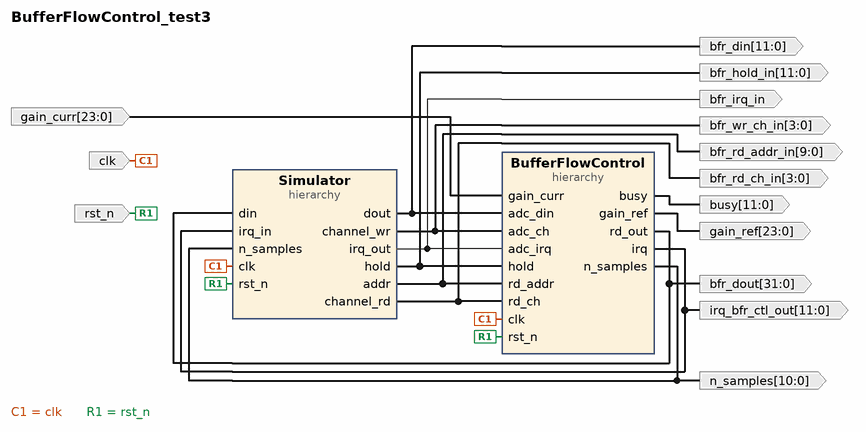
[diagram p0: block diagram of the top level]
# Vivado block design BufferFlowControl_test3, xczu3eg-sbva484-1-i, Vivado 2020.2
create_bd_design BufferFlowControl_test3

create_bd_port -dir I -type clk clk
create_bd_port -dir I -from 23 -to 0 gain_curr
create_bd_port -dir O -from 23 -to 0 gain_ref
create_bd_port -dir I -type rst rst_n
create_bd_port -dir O -from 11 -to 0 busy
create_bd_port -dir O -from 10 -to 0 n_samples
create_bd_port -dir O -from 11 -to 0 irq_bfr_ctl_out
create_bd_port -dir O -from 31 -to 0 bfr_dout
create_bd_port -dir O bfr_irq_in
create_bd_port -dir O -from 11 -to 0 bfr_din
create_bd_port -dir O -from 3 -to 0 bfr_wr_ch_in
create_bd_port -dir O -from 11 -to 0 bfr_hold_in
create_bd_port -dir O -from 9 -to 0 bfr_rd_addr_in
create_bd_port -dir O -from 3 -to 0 bfr_rd_ch_in

create_bd_cell -type hier BufferFlowControl
create_bd_cell -type hier Simulator

# ---- hierarchy /BufferFlowControl ----
current_bd_instance /BufferFlowControl
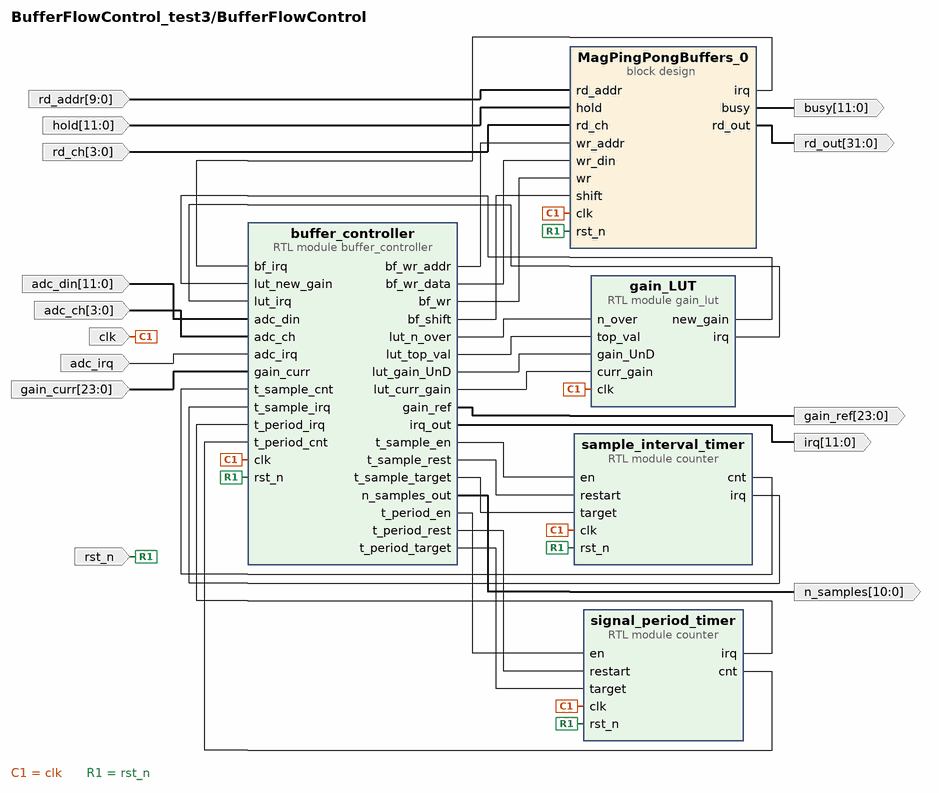
[diagram p1: block diagram inside /BufferFlowControl]
create_bd_pin -dir I -type clk clk
create_bd_pin -dir I -type rst rst_n
create_bd_pin -dir I -from 11 -to 0 adc_din
create_bd_pin -dir I -from 3 -to 0 adc_ch
create_bd_pin -dir I -type intr adc_irq
create_bd_pin -dir I -from 23 -to 0 gain_curr
create_bd_pin -dir O -from 23 -to 0 gain_ref
create_bd_pin -dir O -from 10 -to 0 n_samples
create_bd_pin -dir O -from 11 -to 0 irq
create_bd_pin -dir I -from 9 -to 0 rd_addr
create_bd_pin -dir I -from 11 -to 0 hold
create_bd_pin -dir I -from 3 -to 0 rd_ch
create_bd_pin -dir O -from 11 -to 0 busy
create_bd_pin -dir O -from 31 -to 0 rd_out

create_bd_cell -type module -reference counter sample_interval_timer
set_property -dict {CONFIG.auto_rst {"0"} CONFIG.n_bits 20} [get_bd_cells sample_interval_timer]
create_bd_cell -type module -reference counter signal_period_timer
set_property -dict {CONFIG.auto_rst {"0"} CONFIG.n_bits 21} [get_bd_cells signal_period_timer]
create_bd_cell -type module -reference gain_lut gain_LUT
create_bd_cell -type container -reference MagPingPongBuffers MagPingPongBuffers_0
set_property -dict [list \
  CONFIG.ACTIVE_SIM_BD MagPingPongBuffers.bd \
  CONFIG.ACTIVE_SYNTH_BD MagPingPongBuffers.bd \
  CONFIG.ENABLE_DFX 0 \
  CONFIG.LIST_SIM_BD MagPingPongBuffers.bd \
  CONFIG.LIST_SYNTH_BD MagPingPongBuffers.bd \
  CONFIG.LOCK_PROPAGATE 0 \
  CONFIG.TRAINING_MODULE MagPingPongBuffers.bd \
] [get_bd_cells MagPingPongBuffers_0]
create_bd_cell -type module -reference buffer_controller buffer_controller
set_property -dict {CONFIG.bf_addr_n_bits 10} [get_bd_cells buffer_controller]

# ---- hierarchy /Simulator ----
current_bd_instance /Simulator
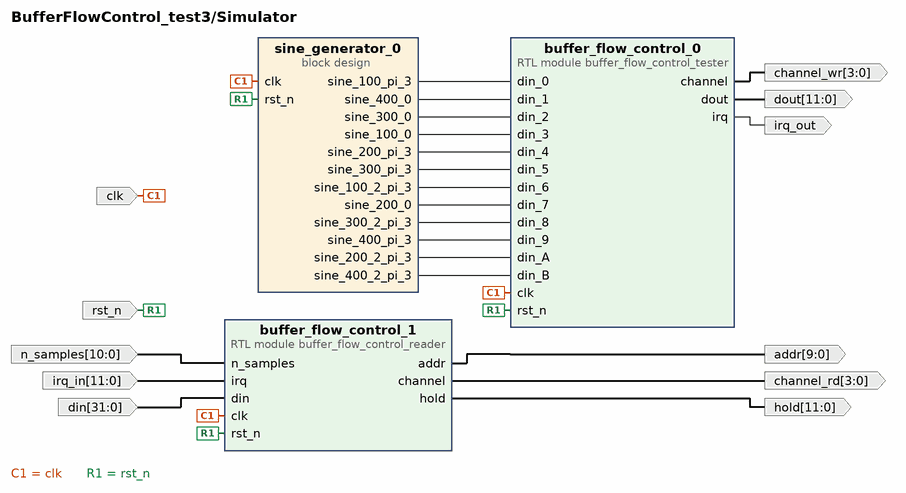
[diagram p2: block diagram inside /Simulator]
create_bd_pin -dir I -type clk clk
create_bd_pin -dir I -type rst rst_n
create_bd_pin -dir O irq_out
create_bd_pin -dir O -from 11 -to 0 dout
create_bd_pin -dir O -from 3 -to 0 channel_wr
create_bd_pin -dir O -from 11 -to 0 hold
create_bd_pin -dir O -from 9 -to 0 addr
create_bd_pin -dir O -from 3 -to 0 channel_rd
create_bd_pin -dir I -from 10 -to 0 n_samples
create_bd_pin -dir I -from 11 -to 0 irq_in
create_bd_pin -dir I -from 31 -to 0 din

create_bd_cell -type module -reference buffer_flow_control_tester buffer_flow_control_0
create_bd_cell -type container -reference sine_generator sine_generator_0
set_property -dict [list \
  CONFIG.ACTIVE_SIM_BD sine_generator.bd \
  CONFIG.ACTIVE_SYNTH_BD sine_generator.bd \
  CONFIG.ENABLE_DFX 0 \
  CONFIG.LIST_SIM_BD sine_generator.bd \
  CONFIG.LIST_SYNTH_BD sine_generator.bd \
  CONFIG.LOCK_PROPAGATE 0 \
  CONFIG.TRAINING_MODULE sine_generator.bd \
] [get_bd_cells sine_generator_0]
create_bd_cell -type module -reference buffer_flow_control_reader buffer_flow_control_1

# ---- connections ----

current_bd_instance /BufferFlowControl
connect_bd_net -net buffer_controller_t_sm_mg_int_en [get_bd_pins buffer_controller/t_sample_en] [get_bd_pins sample_interval_timer/en]
connect_bd_net -net buffer_controller_t_sm_mg_int_rest [get_bd_pins buffer_controller/t_sample_rest] [get_bd_pins sample_interval_timer/restart]
connect_bd_net [get_bd_pins buffer_controller/t_sample_target] [get_bd_pins sample_interval_timer/target]
connect_bd_net -net sample_mag_interval_timer_cnt [get_bd_pins sample_interval_timer/cnt] [get_bd_pins buffer_controller/t_sample_cnt]
connect_bd_net -net sample_mag_interval_timer_irq [get_bd_pins sample_interval_timer/irq] [get_bd_pins buffer_controller/t_sample_irq]
connect_bd_net -net buffer_controller_t_sg_prd_en [get_bd_pins buffer_controller/t_period_en] [get_bd_pins signal_period_timer/en]
connect_bd_net -net buffer_controller_t_sg_prd_rest [get_bd_pins buffer_controller/t_period_rest] [get_bd_pins signal_period_timer/restart]
connect_bd_net [get_bd_pins signal_period_timer/irq] [get_bd_pins buffer_controller/t_period_irq]
connect_bd_net [get_bd_pins signal_period_timer/cnt] [get_bd_pins buffer_controller/t_period_cnt]
connect_bd_net [get_bd_pins buffer_controller/t_period_target] [get_bd_pins signal_period_timer/target]
connect_bd_net [get_bd_pins buffer_controller/lut_n_over] [get_bd_pins gain_LUT/n_over]
connect_bd_net [get_bd_pins buffer_controller/lut_top_val] [get_bd_pins gain_LUT/top_val]
connect_bd_net [get_bd_pins buffer_controller/lut_gain_UnD] [get_bd_pins gain_LUT/gain_UnD]
connect_bd_net [get_bd_pins buffer_controller/lut_curr_gain] [get_bd_pins gain_LUT/curr_gain]
connect_bd_net [get_bd_pins gain_LUT/new_gain] [get_bd_pins buffer_controller/lut_new_gain]
connect_bd_net [get_bd_pins gain_LUT/irq] [get_bd_pins buffer_controller/lut_irq]
connect_bd_net [get_bd_pins clk] \
  [get_bd_pins signal_period_timer/clk] [get_bd_pins sample_interval_timer/clk] [get_bd_pins gain_LUT/clk] \
  [get_bd_pins MagPingPongBuffers_0/clk] [get_bd_pins buffer_controller/clk]
connect_bd_net [get_bd_pins rst_n] \
  [get_bd_pins signal_period_timer/rst_n] [get_bd_pins sample_interval_timer/rst_n] [get_bd_pins MagPingPongBuffers_0/rst_n] \
  [get_bd_pins buffer_controller/rst_n]
connect_bd_net [get_bd_pins adc_din] [get_bd_pins buffer_controller/adc_din]
connect_bd_net [get_bd_pins adc_ch] [get_bd_pins buffer_controller/adc_ch]
connect_bd_net [get_bd_pins adc_irq] [get_bd_pins buffer_controller/adc_irq]
connect_bd_net [get_bd_pins gain_curr] [get_bd_pins buffer_controller/gain_curr]
connect_bd_net [get_bd_pins buffer_controller/gain_ref] [get_bd_pins gain_ref]
connect_bd_net [get_bd_pins buffer_controller/n_samples_out] [get_bd_pins n_samples]
connect_bd_net [get_bd_pins buffer_controller/irq_out] [get_bd_pins irq]
connect_bd_net [get_bd_pins rd_addr] [get_bd_pins MagPingPongBuffers_0/rd_addr]
connect_bd_net [get_bd_pins hold] [get_bd_pins MagPingPongBuffers_0/hold]
connect_bd_net [get_bd_pins rd_ch] [get_bd_pins MagPingPongBuffers_0/rd_ch]
connect_bd_net [get_bd_pins MagPingPongBuffers_0/busy] [get_bd_pins busy]
connect_bd_net [get_bd_pins MagPingPongBuffers_0/rd_out] [get_bd_pins rd_out]
connect_bd_net [get_bd_pins MagPingPongBuffers_0/irq] [get_bd_pins buffer_controller/bf_irq]
connect_bd_net [get_bd_pins buffer_controller/bf_wr_addr] [get_bd_pins MagPingPongBuffers_0/wr_addr]
connect_bd_net [get_bd_pins buffer_controller/bf_wr_data] [get_bd_pins MagPingPongBuffers_0/wr_din]
connect_bd_net [get_bd_pins buffer_controller/bf_wr] [get_bd_pins MagPingPongBuffers_0/wr]
connect_bd_net [get_bd_pins buffer_controller/bf_shift] [get_bd_pins MagPingPongBuffers_0/shift]

current_bd_instance /Simulator
connect_bd_net [get_bd_pins sine_generator_0/sine_100_pi_3] [get_bd_pins buffer_flow_control_0/din_0]
connect_bd_net [get_bd_pins sine_generator_0/sine_400_0] [get_bd_pins buffer_flow_control_0/din_1]
connect_bd_net [get_bd_pins sine_generator_0/sine_300_0] [get_bd_pins buffer_flow_control_0/din_2]
connect_bd_net [get_bd_pins sine_generator_0/sine_100_0] [get_bd_pins buffer_flow_control_0/din_3]
connect_bd_net [get_bd_pins sine_generator_0/sine_200_pi_3] [get_bd_pins buffer_flow_control_0/din_4]
connect_bd_net [get_bd_pins sine_generator_0/sine_300_pi_3] [get_bd_pins buffer_flow_control_0/din_5]
connect_bd_net [get_bd_pins sine_generator_0/sine_100_2_pi_3] [get_bd_pins buffer_flow_control_0/din_6]
connect_bd_net [get_bd_pins sine_generator_0/sine_200_0] [get_bd_pins buffer_flow_control_0/din_7]
connect_bd_net [get_bd_pins sine_generator_0/sine_300_2_pi_3] [get_bd_pins buffer_flow_control_0/din_8]
connect_bd_net [get_bd_pins sine_generator_0/sine_400_pi_3] [get_bd_pins buffer_flow_control_0/din_9]
connect_bd_net [get_bd_pins sine_generator_0/sine_200_2_pi_3] [get_bd_pins buffer_flow_control_0/din_A]
connect_bd_net [get_bd_pins sine_generator_0/sine_400_2_pi_3] [get_bd_pins buffer_flow_control_0/din_B]
connect_bd_net [get_bd_pins clk] [get_bd_pins sine_generator_0/clk] [get_bd_pins buffer_flow_control_0/clk] [get_bd_pins buffer_flow_control_1/clk]
connect_bd_net [get_bd_pins rst_n] \
  [get_bd_pins sine_generator_0/rst_n] [get_bd_pins buffer_flow_control_0/rst_n] [get_bd_pins buffer_flow_control_1/rst_n]
connect_bd_net -net adc_irq_1 [get_bd_pins buffer_flow_control_0/irq] [get_bd_pins irq_out]
connect_bd_net -net adc_din_1 [get_bd_pins buffer_flow_control_0/dout] [get_bd_pins dout]
connect_bd_net -net adc_ch_1 [get_bd_pins buffer_flow_control_0/channel] [get_bd_pins channel_wr]
connect_bd_net [get_bd_pins buffer_flow_control_1/hold] [get_bd_pins hold]
connect_bd_net [get_bd_pins buffer_flow_control_1/addr] [get_bd_pins addr]
connect_bd_net [get_bd_pins buffer_flow_control_1/channel] [get_bd_pins channel_rd]
connect_bd_net -net BufferFlowControl_n_samples [get_bd_pins n_samples] [get_bd_pins buffer_flow_control_1/n_samples]
connect_bd_net -net BufferFlowControl_irq [get_bd_pins irq_in] [get_bd_pins buffer_flow_control_1/irq]
connect_bd_net -net BufferFlowControl_rd_out [get_bd_pins din] [get_bd_pins buffer_flow_control_1/din]

current_bd_instance /
connect_bd_net -net buffer_controller_gain_ref [get_bd_pins BufferFlowControl/gain_ref] [get_bd_ports gain_ref]
connect_bd_net [get_bd_ports clk] [get_bd_pins BufferFlowControl/clk] [get_bd_pins Simulator/clk]
connect_bd_net [get_bd_ports gain_curr] [get_bd_pins BufferFlowControl/gain_curr]
connect_bd_net [get_bd_ports rst_n] [get_bd_pins BufferFlowControl/rst_n] [get_bd_pins Simulator/rst_n]
connect_bd_net -net MagPingPongBuffers_0_busy1 [get_bd_pins BufferFlowControl/busy] [get_bd_ports busy]
connect_bd_net -net adc_din_1 [get_bd_pins Simulator/dout] [get_bd_pins BufferFlowControl/adc_din] [get_bd_ports bfr_din]
connect_bd_net -net adc_ch_1 [get_bd_pins Simulator/channel_wr] [get_bd_pins BufferFlowControl/adc_ch] [get_bd_ports bfr_wr_ch_in]
connect_bd_net -net adc_irq_1 [get_bd_pins Simulator/irq_out] [get_bd_pins BufferFlowControl/adc_irq] [get_bd_ports bfr_irq_in]
connect_bd_net -net buffer_flow_control_1_hold [get_bd_pins Simulator/hold] [get_bd_pins BufferFlowControl/hold] [get_bd_ports bfr_hold_in]
connect_bd_net -net buffer_flow_control_1_addr [get_bd_pins Simulator/addr] [get_bd_pins BufferFlowControl/rd_addr] [get_bd_ports bfr_rd_addr_in]
connect_bd_net -net buffer_flow_control_1_channel [get_bd_pins Simulator/channel_rd] [get_bd_pins BufferFlowControl/rd_ch] [get_bd_ports bfr_rd_ch_in]
connect_bd_net [get_bd_pins BufferFlowControl/rd_out] [get_bd_pins Simulator/din] [get_bd_ports bfr_dout]
connect_bd_net [get_bd_pins BufferFlowControl/irq] [get_bd_pins Simulator/irq_in] [get_bd_ports irq_bfr_ctl_out]
connect_bd_net [get_bd_pins BufferFlowControl/n_samples] [get_bd_pins Simulator/n_samples] [get_bd_ports n_samples]

validate_bd_design
save_bd_design
